# Altium schematic sheet TV DAC.SchDoc
size A4
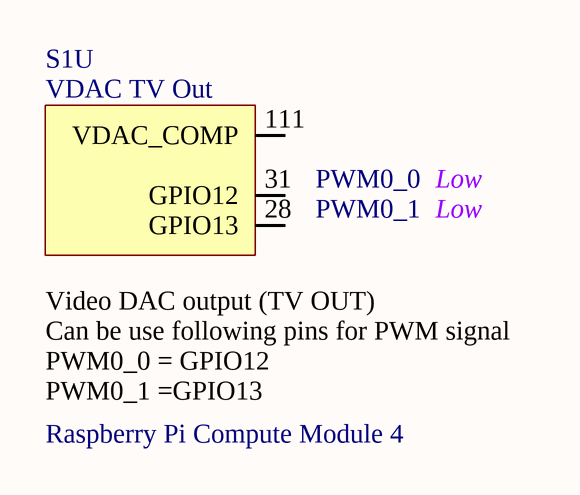
[diagram p0: TV DAC.SchDoc]

## Parts
S1  Raspberry Pi Compute Module 4  [CM4-F40C-100DS-0.4v_1.5mm_0mm]  (part U of 21)

## Nets

Not connected (* = marked no-connect by the designer): S1 28(GPIO13) 31(GPIO12) 111(VDAC_COMP)

## Notes on the sheet
- Title
- Size:
- Date:
- A4
- Number:
- Time:
- Revision:
- Sheet
- of
- Q-Wave Systems Co.,Ltd
- 65/2 Moo 1 Beung
- Sriracha Chonburi
- Thailand
- File:
- (in symbol CM4, part U) VDAC TV Out; PWM0_0; Low; PWM0_1; Video DAC output (TV OUT) / Can be use following pins for PWM signal / PWM0_0 = GPIO12 / PWM0_1 =GPIO13

## Library data of the parts
S1 = CM4: Raspberry Pi Compute Module 4 by Amornthep Phunsin